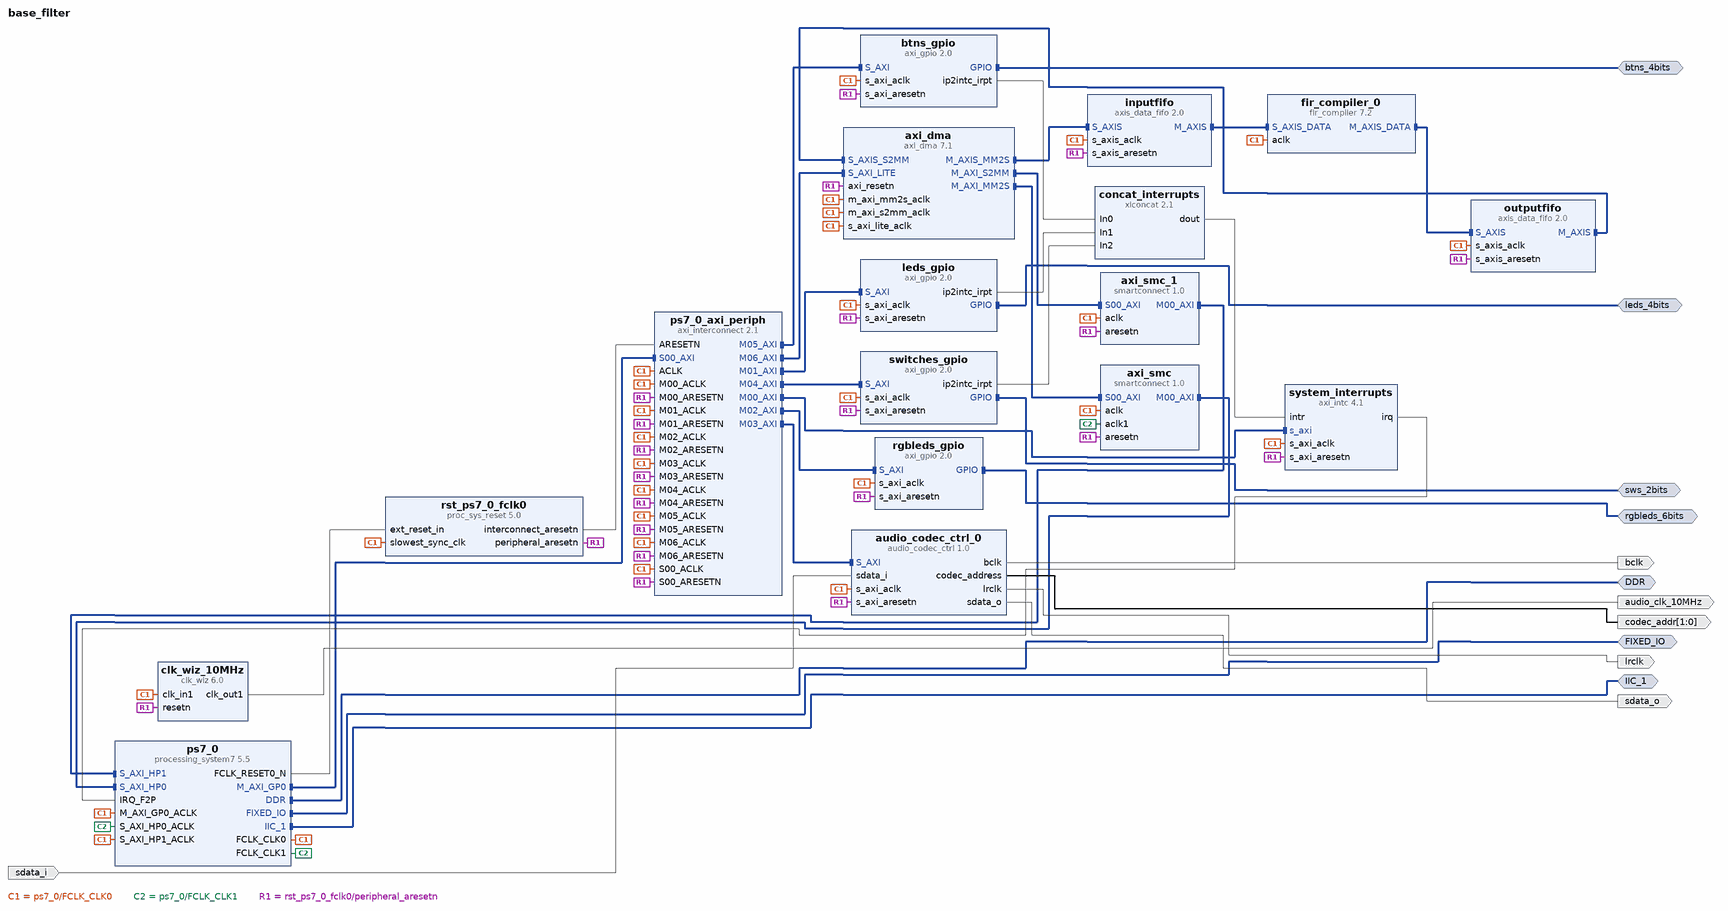
[diagram p0: block diagram of the top level]
# Vivado block design base_filter, xc7z020clg400-1, Vivado 2019.2
create_bd_design base_filter

create_bd_intf_port -mode Master -vlnv xilinx.com:interface:ddrx_rtl:1.0 DDR
create_bd_intf_port -mode Master -vlnv xilinx.com:display_processing_system7:fixedio_rtl:1.0 FIXED_IO
create_bd_intf_port -mode Master -vlnv xilinx.com:interface:iic_rtl:1.0 IIC_1
create_bd_intf_port -mode Master -vlnv xilinx.com:interface:gpio_rtl:1.0 btns_4bits
create_bd_intf_port -mode Master -vlnv xilinx.com:interface:gpio_rtl:1.0 leds_4bits
create_bd_intf_port -mode Master -vlnv xilinx.com:interface:gpio_rtl:1.0 rgbleds_6bits
create_bd_intf_port -mode Master -vlnv xilinx.com:interface:gpio_rtl:1.0 sws_2bits
create_bd_port -dir O -type clk audio_clk_10MHz
create_bd_port -dir O bclk
create_bd_port -dir O -from 1 -to 0 codec_addr
create_bd_port -dir O lrclk
create_bd_port -dir I sdata_i
create_bd_port -dir O sdata_o

create_bd_cell -type ip -vlnv xilinx.com:user:audio_codec_ctrl:1.0 audio_codec_ctrl_0
create_bd_cell -type ip -vlnv xilinx.com:ip:axi_dma:7.1 axi_dma
set_property -dict [list \
  CONFIG.c_include_sg 0 \
  CONFIG.c_m_axi_mm2s_data_width 64 \
  CONFIG.c_m_axi_s2mm_data_width 64 \
  CONFIG.c_mm2s_burst_size 64 \
  CONFIG.c_s2mm_burst_size 64 \
  CONFIG.c_sg_length_width 26 \
] [get_bd_cells axi_dma]
create_bd_cell -type ip -vlnv xilinx.com:ip:smartconnect:1.0 axi_smc
set_property -dict {CONFIG.NUM_CLKS 2 CONFIG.NUM_SI 1} [get_bd_cells axi_smc]
create_bd_cell -type ip -vlnv xilinx.com:ip:smartconnect:1.0 axi_smc_1
set_property -dict {CONFIG.NUM_SI 1} [get_bd_cells axi_smc_1]
create_bd_cell -type ip -vlnv xilinx.com:ip:axi_gpio:2.0 btns_gpio
set_property -dict {CONFIG.C_ALL_INPUTS 1 CONFIG.C_GPIO_WIDTH 4 CONFIG.C_INTERRUPT_PRESENT 1} [get_bd_cells btns_gpio]
create_bd_cell -type ip -vlnv xilinx.com:ip:clk_wiz:6.0 clk_wiz_10MHz
set_property -dict [list \
  CONFIG.CLKOUT1_JITTER 290.478 \
  CONFIG.CLKOUT1_PHASE_ERROR 133.882 \
  CONFIG.CLKOUT1_REQUESTED_OUT_FREQ 10.000 \
  CONFIG.MMCM_CLKFBOUT_MULT_F 15.625 \
  CONFIG.MMCM_CLKOUT0_DIVIDE_F 78.125 \
  CONFIG.MMCM_DIVCLK_DIVIDE 2 \
  CONFIG.RESET_PORT resetn \
  CONFIG.RESET_TYPE ACTIVE_LOW \
] [get_bd_cells clk_wiz_10MHz]
create_bd_cell -type ip -vlnv xilinx.com:ip:xlconcat:2.1 concat_interrupts
set_property -dict {CONFIG.IN0_WIDTH 1 CONFIG.NUM_PORTS 3} [get_bd_cells concat_interrupts]
create_bd_cell -type ip -vlnv xilinx.com:ip:fir_compiler:7.2 fir_compiler_0
set_property -dict [list \
  CONFIG.Clock_Frequency 100.0 \
  CONFIG.CoefficientSource COE_File \
  CONFIG.Coefficient_File ../../../../../../../../../../../Users/Gonglingyu/Desktop/mycoefile.coe \
  CONFIG.Coefficient_Fractional_Bits 0 \
  CONFIG.Coefficient_Sets 1 \
  CONFIG.Coefficient_Sign Signed \
  CONFIG.Coefficient_Structure Inferred \
  CONFIG.Coefficient_Width 16 \
  CONFIG.DATA_Has_TLAST Packet_Framing \
  CONFIG.Data_Sign Signed \
  CONFIG.Data_Width 32 \
  CONFIG.Filter_Architecture Systolic_Multiply_Accumulate \
  CONFIG.M_DATA_Has_TREADY false \
  CONFIG.Output_Rounding_Mode Non_Symmetric_Rounding_Up \
  CONFIG.Output_Width 32 \
  CONFIG.Quantization Integer_Coefficients \
  CONFIG.S_DATA_Has_FIFO false \
  CONFIG.Sample_Frequency 0.048 \
] [get_bd_cells fir_compiler_0]
create_bd_cell -type ip -vlnv xilinx.com:ip:axis_data_fifo:2.0 inputfifo
set_property -dict {CONFIG.FIFO_DEPTH 64} [get_bd_cells inputfifo]
create_bd_cell -type ip -vlnv xilinx.com:ip:axi_gpio:2.0 leds_gpio
set_property -dict [list \
  CONFIG.C_ALL_OUTPUTS 1 \
  CONFIG.C_GPIO_WIDTH 4 \
  CONFIG.C_INTERRUPT_PRESENT 1 \
  CONFIG.C_IS_DUAL 0 \
] [get_bd_cells leds_gpio]
create_bd_cell -type ip -vlnv xilinx.com:ip:axis_data_fifo:2.0 outputfifo
set_property -dict {CONFIG.FIFO_DEPTH 64} [get_bd_cells outputfifo]
create_bd_cell -type ip -vlnv xilinx.com:ip:processing_system7:5.5 ps7_0
set_property -dict [list \
  CONFIG.PCW_APU_PERIPHERAL_FREQMHZ 650 \
  CONFIG.PCW_CRYSTAL_PERIPHERAL_FREQMHZ 50 \
  CONFIG.PCW_ENET0_ENET0_IO {MIO 16 .. 27} \
  CONFIG.PCW_ENET0_GRP_MDIO_ENABLE 1 \
  CONFIG.PCW_ENET0_GRP_MDIO_IO {MIO 52 .. 53} \
  CONFIG.PCW_ENET0_PERIPHERAL_ENABLE 1 \
  CONFIG.PCW_EN_CLK1_PORT 1 \
  CONFIG.PCW_EN_CLK2_PORT 1 \
  CONFIG.PCW_EN_CLK3_PORT 1 \
  CONFIG.PCW_FCLK_CLK1_BUF TRUE \
  CONFIG.PCW_FCLK_CLK2_BUF TRUE \
  CONFIG.PCW_FCLK_CLK3_BUF TRUE \
  CONFIG.PCW_FPGA0_PERIPHERAL_FREQMHZ 100 \
  CONFIG.PCW_FPGA1_PERIPHERAL_FREQMHZ 142 \
  CONFIG.PCW_FPGA2_PERIPHERAL_FREQMHZ 200 \
  CONFIG.PCW_FPGA3_PERIPHERAL_FREQMHZ 100 \
  CONFIG.PCW_FPGA_FCLK1_ENABLE 1 \
  CONFIG.PCW_FPGA_FCLK2_ENABLE 1 \
  CONFIG.PCW_FPGA_FCLK3_ENABLE 1 \
  CONFIG.PCW_GPIO_EMIO_GPIO_ENABLE 1 \
  CONFIG.PCW_GPIO_EMIO_GPIO_IO 10 \
  CONFIG.PCW_GPIO_EMIO_GPIO_WIDTH 10 \
  CONFIG.PCW_GPIO_MIO_GPIO_ENABLE 0 \
  CONFIG.PCW_I2C0_GRP_INT_ENABLE 1 \
  CONFIG.PCW_I2C0_GRP_INT_IO EMIO \
  CONFIG.PCW_I2C0_I2C0_IO {MIO 50 .. 51} \
  CONFIG.PCW_I2C0_PERIPHERAL_ENABLE 1 \
  CONFIG.PCW_I2C1_I2C1_IO EMIO \
  CONFIG.PCW_I2C1_PERIPHERAL_ENABLE 1 \
  CONFIG.PCW_I2C_PERIPHERAL_FREQMHZ 108.333336 \
  CONFIG.PCW_IRQ_F2P_INTR 1 \
  CONFIG.PCW_PERIPHERAL_BOARD_PRESET None \
  CONFIG.PCW_PRESET_BANK1_VOLTAGE {LVCMOS 1.8V} \
  CONFIG.PCW_QSPI_GRP_FBCLK_ENABLE 1 \
  CONFIG.PCW_QSPI_GRP_FBCLK_IO {MIO 8} \
  CONFIG.PCW_QSPI_GRP_SINGLE_SS_ENABLE 1 \
  CONFIG.PCW_QSPI_GRP_SINGLE_SS_IO {MIO 1 .. 6} \
  CONFIG.PCW_QSPI_PERIPHERAL_ENABLE 1 \
  CONFIG.PCW_QSPI_QSPI_IO {MIO 1 .. 6} \
  CONFIG.PCW_SD0_GRP_CD_ENABLE 1 \
  CONFIG.PCW_SD0_GRP_CD_IO {MIO 47} \
  CONFIG.PCW_SD0_GRP_WP_ENABLE 0 \
  CONFIG.PCW_SD0_PERIPHERAL_ENABLE 1 \
  CONFIG.PCW_SD0_SD0_IO {MIO 40 .. 45} \
  CONFIG.PCW_SDIO_PERIPHERAL_FREQMHZ 50 \
  CONFIG.PCW_SINGLE_QSPI_DATA_MODE x4 \
  CONFIG.PCW_UART0_PERIPHERAL_ENABLE 1 \
  CONFIG.PCW_UART0_UART0_IO {MIO 14 .. 15} \
  CONFIG.PCW_UART1_PERIPHERAL_ENABLE 0 \
  CONFIG.PCW_UART_PERIPHERAL_FREQMHZ 100 \
  CONFIG.PCW_UIPARAM_DDR_BUS_WIDTH {16 Bit} \
  CONFIG.PCW_UIPARAM_DDR_FREQ_MHZ 525 \
  CONFIG.PCW_UIPARAM_DDR_PARTNO Custom \
  CONFIG.PCW_USB0_PERIPHERAL_ENABLE 1 \
  CONFIG.PCW_USB0_USB0_IO {MIO 28 .. 39} \
  CONFIG.PCW_USE_FABRIC_INTERRUPT 1 \
  CONFIG.PCW_USE_S_AXI_HP0 1 \
  CONFIG.PCW_USE_S_AXI_HP1 1 \
] [get_bd_cells ps7_0]
# 482 more settings of ps7_0 are not shown: defaults, MIO pin electricals, DDR timing, and values the tool derives
create_bd_cell -type ip -vlnv xilinx.com:ip:axi_interconnect:2.1 ps7_0_axi_periph
set_property -dict [list \
  CONFIG.M00_HAS_REGSLICE 1 \
  CONFIG.M01_HAS_REGSLICE 1 \
  CONFIG.M02_HAS_REGSLICE 1 \
  CONFIG.M03_HAS_REGSLICE 1 \
  CONFIG.M04_HAS_REGSLICE 1 \
  CONFIG.M05_HAS_REGSLICE 1 \
  CONFIG.M06_HAS_REGSLICE 1 \
  CONFIG.M07_HAS_REGSLICE 1 \
  CONFIG.M08_HAS_REGSLICE 1 \
  CONFIG.M09_HAS_REGSLICE 1 \
  CONFIG.NUM_MI 7 \
  CONFIG.S00_HAS_REGSLICE 1 \
] [get_bd_cells ps7_0_axi_periph]
create_bd_cell -type ip -vlnv xilinx.com:ip:axi_gpio:2.0 rgbleds_gpio
set_property -dict {CONFIG.C_ALL_OUTPUTS 1 CONFIG.C_GPIO_WIDTH 6} [get_bd_cells rgbleds_gpio]
create_bd_cell -type ip -vlnv xilinx.com:ip:proc_sys_reset:5.0 rst_ps7_0_fclk0
create_bd_cell -type ip -vlnv xilinx.com:ip:axi_gpio:2.0 switches_gpio
set_property -dict [list \
  CONFIG.C_ALL_INPUTS 1 \
  CONFIG.C_GPIO_WIDTH 2 \
  CONFIG.C_INTERRUPT_PRESENT 1 \
  CONFIG.C_IS_DUAL 0 \
] [get_bd_cells switches_gpio]
create_bd_cell -type ip -vlnv xilinx.com:ip:axi_intc:4.1 system_interrupts
set_property -dict {CONFIG.C_IRQ_CONNECTION 1} [get_bd_cells system_interrupts]

# ---- connections ----

connect_bd_intf_net [get_bd_intf_pins axi_dma/M_AXIS_MM2S] [get_bd_intf_pins inputfifo/S_AXIS]
connect_bd_intf_net [get_bd_intf_pins axi_dma/M_AXI_MM2S] [get_bd_intf_pins axi_smc/S00_AXI]
connect_bd_intf_net [get_bd_intf_pins axi_smc_1/M00_AXI] [get_bd_intf_pins ps7_0/S_AXI_HP1]
connect_bd_intf_net [get_bd_intf_ports DDR] [get_bd_intf_pins ps7_0/DDR]
connect_bd_intf_net [get_bd_intf_pins axi_dma/M_AXI_S2MM] [get_bd_intf_pins axi_smc_1/S00_AXI]
connect_bd_intf_net [get_bd_intf_pins fir_compiler_0/M_AXIS_DATA] [get_bd_intf_pins outputfifo/S_AXIS]
connect_bd_intf_net [get_bd_intf_ports leds_4bits] [get_bd_intf_pins leds_gpio/GPIO]
connect_bd_intf_net -intf_net processing_system7_0_FIXED_IO [get_bd_intf_ports FIXED_IO] [get_bd_intf_pins ps7_0/FIXED_IO]
connect_bd_intf_net [get_bd_intf_ports btns_4bits] [get_bd_intf_pins btns_gpio/GPIO]
connect_bd_intf_net [get_bd_intf_pins axi_dma/S_AXIS_S2MM] [get_bd_intf_pins outputfifo/M_AXIS]
connect_bd_intf_net [get_bd_intf_pins axi_smc/M00_AXI] [get_bd_intf_pins ps7_0/S_AXI_HP0]
connect_bd_intf_net [get_bd_intf_pins fir_compiler_0/S_AXIS_DATA] [get_bd_intf_pins inputfifo/M_AXIS]
connect_bd_intf_net [get_bd_intf_pins btns_gpio/S_AXI] [get_bd_intf_pins ps7_0_axi_periph/M05_AXI]
connect_bd_intf_net [get_bd_intf_pins audio_codec_ctrl_0/S_AXI] [get_bd_intf_pins ps7_0_axi_periph/M03_AXI]
connect_bd_intf_net -intf_net rgbled_gpio_GPIO [get_bd_intf_ports rgbleds_6bits] [get_bd_intf_pins rgbleds_gpio/GPIO]
connect_bd_intf_net -intf_net swsleds_gpio_GPIO [get_bd_intf_ports sws_2bits] [get_bd_intf_pins switches_gpio/GPIO]
connect_bd_intf_net [get_bd_intf_pins ps7_0_axi_periph/M04_AXI] [get_bd_intf_pins switches_gpio/S_AXI]
connect_bd_intf_net [get_bd_intf_pins ps7_0_axi_periph/M02_AXI] [get_bd_intf_pins rgbleds_gpio/S_AXI]
connect_bd_intf_net [get_bd_intf_pins axi_dma/S_AXI_LITE] [get_bd_intf_pins ps7_0_axi_periph/M06_AXI]
connect_bd_intf_net [get_bd_intf_pins ps7_0_axi_periph/M00_AXI] [get_bd_intf_pins system_interrupts/s_axi]
connect_bd_intf_net [get_bd_intf_ports IIC_1] [get_bd_intf_pins ps7_0/IIC_1]
connect_bd_intf_net [get_bd_intf_pins ps7_0/M_AXI_GP0] [get_bd_intf_pins ps7_0_axi_periph/S00_AXI]
connect_bd_intf_net [get_bd_intf_pins leds_gpio/S_AXI] [get_bd_intf_pins ps7_0_axi_periph/M01_AXI]
connect_bd_net [get_bd_ports sdata_i] [get_bd_pins audio_codec_ctrl_0/sdata_i]
connect_bd_net [get_bd_pins audio_codec_ctrl_0/bclk] [get_bd_ports bclk]
connect_bd_net [get_bd_pins audio_codec_ctrl_0/lrclk] [get_bd_ports lrclk]
connect_bd_net [get_bd_pins audio_codec_ctrl_0/sdata_o] [get_bd_ports sdata_o]
connect_bd_net [get_bd_pins audio_codec_ctrl_0/codec_address] [get_bd_ports codec_addr]
connect_bd_net [get_bd_pins btns_gpio/ip2intc_irpt] [get_bd_pins concat_interrupts/In0]
connect_bd_net [get_bd_pins clk_wiz_10MHz/clk_out1] [get_bd_ports audio_clk_10MHz]
connect_bd_net [get_bd_pins concat_interrupts/dout] [get_bd_pins system_interrupts/intr]
connect_bd_net [get_bd_pins leds_gpio/ip2intc_irpt] [get_bd_pins concat_interrupts/In1]
connect_bd_net [get_bd_pins ps7_0/FCLK_CLK0] \
  [get_bd_pins audio_codec_ctrl_0/s_axi_aclk] [get_bd_pins axi_dma/m_axi_mm2s_aclk] [get_bd_pins axi_dma/m_axi_s2mm_aclk] \
  [get_bd_pins axi_dma/s_axi_lite_aclk] [get_bd_pins axi_smc/aclk] [get_bd_pins axi_smc_1/aclk] \
  [get_bd_pins btns_gpio/s_axi_aclk] [get_bd_pins clk_wiz_10MHz/clk_in1] [get_bd_pins fir_compiler_0/aclk] \
  [get_bd_pins inputfifo/s_axis_aclk] [get_bd_pins leds_gpio/s_axi_aclk] [get_bd_pins outputfifo/s_axis_aclk] \
  [get_bd_pins ps7_0/M_AXI_GP0_ACLK] [get_bd_pins ps7_0/S_AXI_HP1_ACLK] [get_bd_pins ps7_0_axi_periph/ACLK] \
  [get_bd_pins ps7_0_axi_periph/M00_ACLK] [get_bd_pins ps7_0_axi_periph/M01_ACLK] [get_bd_pins ps7_0_axi_periph/M02_ACLK] \
  [get_bd_pins ps7_0_axi_periph/M03_ACLK] [get_bd_pins ps7_0_axi_periph/M04_ACLK] [get_bd_pins ps7_0_axi_periph/M05_ACLK] \
  [get_bd_pins ps7_0_axi_periph/M06_ACLK] [get_bd_pins ps7_0_axi_periph/S00_ACLK] [get_bd_pins rgbleds_gpio/s_axi_aclk] \
  [get_bd_pins rst_ps7_0_fclk0/slowest_sync_clk] [get_bd_pins switches_gpio/s_axi_aclk] \
  [get_bd_pins system_interrupts/s_axi_aclk]
connect_bd_net [get_bd_pins ps7_0/FCLK_CLK1] [get_bd_pins axi_smc/aclk1] [get_bd_pins ps7_0/S_AXI_HP0_ACLK]
connect_bd_net [get_bd_pins ps7_0/FCLK_RESET0_N] [get_bd_pins rst_ps7_0_fclk0/ext_reset_in]
connect_bd_net [get_bd_pins rst_ps7_0_fclk0/interconnect_aresetn] [get_bd_pins ps7_0_axi_periph/ARESETN]
connect_bd_net [get_bd_pins rst_ps7_0_fclk0/peripheral_aresetn] \
  [get_bd_pins audio_codec_ctrl_0/s_axi_aresetn] [get_bd_pins axi_dma/axi_resetn] [get_bd_pins axi_smc/aresetn] \
  [get_bd_pins axi_smc_1/aresetn] [get_bd_pins btns_gpio/s_axi_aresetn] [get_bd_pins clk_wiz_10MHz/resetn] \
  [get_bd_pins inputfifo/s_axis_aresetn] [get_bd_pins leds_gpio/s_axi_aresetn] [get_bd_pins outputfifo/s_axis_aresetn] \
  [get_bd_pins ps7_0_axi_periph/M00_ARESETN] [get_bd_pins ps7_0_axi_periph/M01_ARESETN] \
  [get_bd_pins ps7_0_axi_periph/M02_ARESETN] [get_bd_pins ps7_0_axi_periph/M03_ARESETN] \
  [get_bd_pins ps7_0_axi_periph/M04_ARESETN] [get_bd_pins ps7_0_axi_periph/M05_ARESETN] \
  [get_bd_pins ps7_0_axi_periph/M06_ARESETN] [get_bd_pins ps7_0_axi_periph/S00_ARESETN] \
  [get_bd_pins rgbleds_gpio/s_axi_aresetn] [get_bd_pins switches_gpio/s_axi_aresetn] \
  [get_bd_pins system_interrupts/s_axi_aresetn]
connect_bd_net [get_bd_pins switches_gpio/ip2intc_irpt] [get_bd_pins concat_interrupts/In2]
connect_bd_net [get_bd_pins system_interrupts/irq] [get_bd_pins ps7_0/IRQ_F2P]

# ---- address map ----
assign_bd_address -offset 0x00000000 -range 512M -target_address_space [get_bd_addr_spaces axi_dma/Data_MM2S] [get_bd_addr_segs ps7_0/S_AXI_HP0/HP0_DDR_LOWOCM]
assign_bd_address -offset 0x00000000 -range 512M -target_address_space [get_bd_addr_spaces axi_dma/Data_S2MM] [get_bd_addr_segs ps7_0/S_AXI_HP1/HP1_DDR_LOWOCM]
assign_bd_address -offset 0x40400000 -range 64K -target_address_space [get_bd_addr_spaces ps7_0/Data] [get_bd_addr_segs axi_dma/S_AXI_LITE/Reg]
assign_bd_address -offset 0x41200000 -range 64K -target_address_space [get_bd_addr_spaces ps7_0/Data] [get_bd_addr_segs switches_gpio/S_AXI/Reg]
assign_bd_address -offset 0x41210000 -range 64K -target_address_space [get_bd_addr_spaces ps7_0/Data] [get_bd_addr_segs btns_gpio/S_AXI/Reg]
assign_bd_address -offset 0x41240000 -range 64K -target_address_space [get_bd_addr_spaces ps7_0/Data] [get_bd_addr_segs rgbleds_gpio/S_AXI/Reg]
assign_bd_address -offset 0x41250000 -range 64K -target_address_space [get_bd_addr_spaces ps7_0/Data] [get_bd_addr_segs leds_gpio/S_AXI/Reg]
assign_bd_address -offset 0x41800000 -range 64K -target_address_space [get_bd_addr_spaces ps7_0/Data] [get_bd_addr_segs system_interrupts/S_AXI/Reg]
assign_bd_address -offset 0x43C00000 -range 64K -target_address_space [get_bd_addr_spaces ps7_0/Data] [get_bd_addr_segs audio_codec_ctrl_0/S_AXI/reg0]

validate_bd_design
save_bd_design
